# Altium schematic sheet socket.SchDoc
size A4
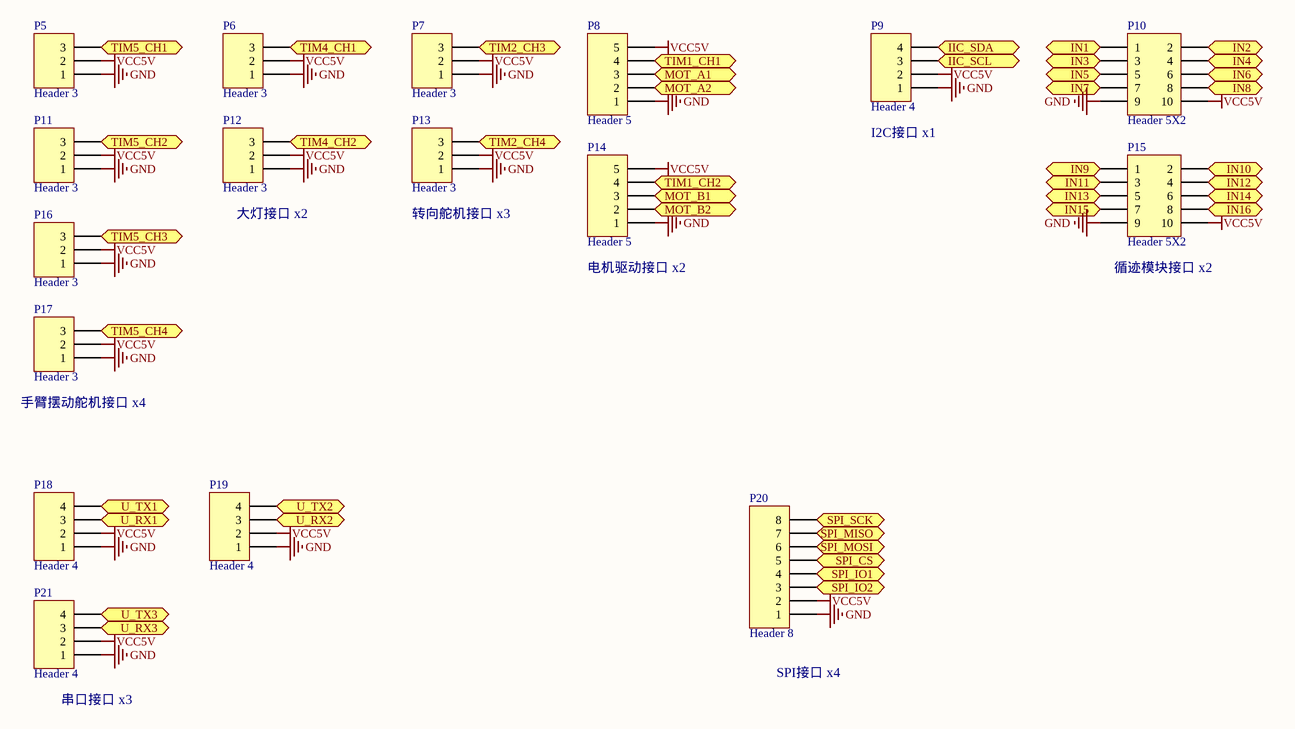
[diagram p0: socket.SchDoc]

## Parts
P5  Header 3  [HDR1X3]
P6  Header 3  [HDR1X3]
P7  Header 3  [HDR1X3]
P8  Header 5  [HDR1X5]
P9  Header 4  [HDR1X4]
P10  Header 5X2  [HDR2X5]
P11  Header 3  [HDR1X3]
P12  Header 3  [HDR1X3]
P13  Header 3  [HDR1X3]
P14  Header 5  [HDR1X5]
P15  Header 5X2  [HDR2X5]
P16  Header 3  [HDR1X3]
P17  Header 3  [HDR1X3]
P18  Header 4  [HDR1X4]
P19  Header 4  [HDR1X4]
P20  Header 8  [HDR1X8]
P21  Header 4  [HDR1X4]

## Ports
IIC_SCL (in), IIC_SDA (in), IN1 (in), IN2 (in), IN3 (in), IN4 (in), IN5 (in), IN6 (in), IN7 (in), IN8 (in), IN9 (in), IN10 (in), IN11 (in), IN12 (in), IN13 (in), IN14 (in), IN15 (in), IN16 (in), MOT_A1 (in), MOT_A2 (in), MOT_B1 (in), MOT_B2 (in), SPI_CS (in), SPI_IO1 (in), SPI_IO2 (in), SPI_MISO (in), SPI_MOSI (in), SPI_SCK (in), TIM1_CH1 (in), TIM1_CH2 (in), TIM2_CH3 (in), TIM2_CH4 (in), TIM4_CH1 (in), TIM4_CH2 (in), TIM5_CH1 (in), TIM5_CH2 (in), TIM5_CH3 (in), TIM5_CH4 (in), U_RX1 (in), U_RX2 (in), U_RX3 (in), U_TX1 (in), U_TX2 (in), U_TX3 (in)

## Nets
GND: P5.1 P6.1 P7.1 P8.1 P9.1 P10.9 P11.1 P12.1 P13.1 P14.1 P15.9 P16.1 P17.1 P18.1 P19.1 P20.1 P21.1
VCC5V: P5.2 P6.2 P7.2 P8.5 P9.2 P10.10 P11.2 P12.2 P13.2 P14.5 P15.10 P16.2 P17.2 P18.2 P19.2 P20.2 P21.2
IIC_SCL: P9.3 ; port IIC_SCL
IIC_SDA: P9.4 ; port IIC_SDA
IN1: P10.1 ; port IN1
IN2: P10.2 ; port IN2
IN3: P10.3 ; port IN3
IN4: P10.4 ; port IN4
IN5: P10.5 ; port IN5
IN6: P10.6 ; port IN6
IN7: P10.7 ; port IN7
IN8: P10.8 ; port IN8
IN9: P15.1 ; port IN9
IN10: P15.2 ; port IN10
IN11: P15.3 ; port IN11
IN12: P15.4 ; port IN12
IN13: P15.5 ; port IN13
IN14: P15.6 ; port IN14
IN15: P15.7 ; port IN15
IN16: P15.8 ; port IN16
MOT_A1: P8.3 ; port MOT_A1
MOT_A2: P8.2 ; port MOT_A2
MOT_B1: P14.3 ; port MOT_B1
MOT_B2: P14.2 ; port MOT_B2
SPI_CS: P20.5 ; port SPI_CS
SPI_IO1: P20.4 ; port SPI_IO1
SPI_IO2: P20.3 ; port SPI_IO2
SPI_MISO: P20.7 ; port SPI_MISO
SPI_MOSI: P20.6 ; port SPI_MOSI
SPI_SCK: P20.8 ; port SPI_SCK
TIM1_CH1: P8.4 ; port TIM1_CH1
TIM1_CH2: P14.4 ; port TIM1_CH2
TIM2_CH3: P7.3 ; port TIM2_CH3
TIM2_CH4: P13.3 ; port TIM2_CH4
TIM4_CH1: P6.3 ; port TIM4_CH1
TIM4_CH2: P12.3 ; port TIM4_CH2
TIM5_CH1: P5.3 ; port TIM5_CH1
TIM5_CH2: P11.3 ; port TIM5_CH2
TIM5_CH3: P16.3 ; port TIM5_CH3
TIM5_CH4: P17.3 ; port TIM5_CH4
U_RX1: P18.3 ; port U_RX1
U_RX2: P19.3 ; port U_RX2
U_RX3: P21.3 ; port U_RX3
U_TX1: P18.4 ; port U_TX1
U_TX2: P19.4 ; port U_TX2
U_TX3: P21.4 ; port U_TX3

## Notes on the sheet
- (near P9) I2C接口 x1
- (near P12) 大灯接口 x2
- (near P13) 转向舵机接口 x3
- (near P14) 电机驱动接口 x2
- (near P15) 循迹模块接口 x2
- (near P17) 手臂摆动舵机接口 x4
- (near P20) SPI接口 x4
- (near P21) 串口接口 x3
- Title
- Size:
- Date:
- A4
- Number:
- Time:
- Revision:
- Sheet
- of
- File:

## Library data of the parts
P5-P7 P11-P13 P16 P17 = Header 3: Header, 3-Pin; LatestRevisionDate: 17-Jul-2002; LatestRevisionNote: Re-released for DXP Platform.; Publisher: Altium Limited
P8 P14 = Header 5: Header, 5-Pin; LatestRevisionDate: 17-Jul-2002; LatestRevisionNote: Re-released for DXP Platform.; Publisher: Altium Limited
P9 P18 P19 P21 = Header 4: Header, 4-Pin; LatestRevisionDate: 17-Jul-2002; LatestRevisionNote: Re-released for DXP Platform.; Publisher: Altium Limited
P10 P15 = Header 5X2: Header, 5-Pin, Dual row; LatestRevisionDate: 17-Jul-2002; LatestRevisionNote: Re-released for DXP Platform.; Publisher: Altium Limited
P20 = Header 8: Header, 8-Pin; LatestRevisionDate: 17-Jul-2002; LatestRevisionNote: Re-released for DXP Platform.; Publisher: Altium Limited